# Altium schematic sheet CAN.SchDoc
size A4
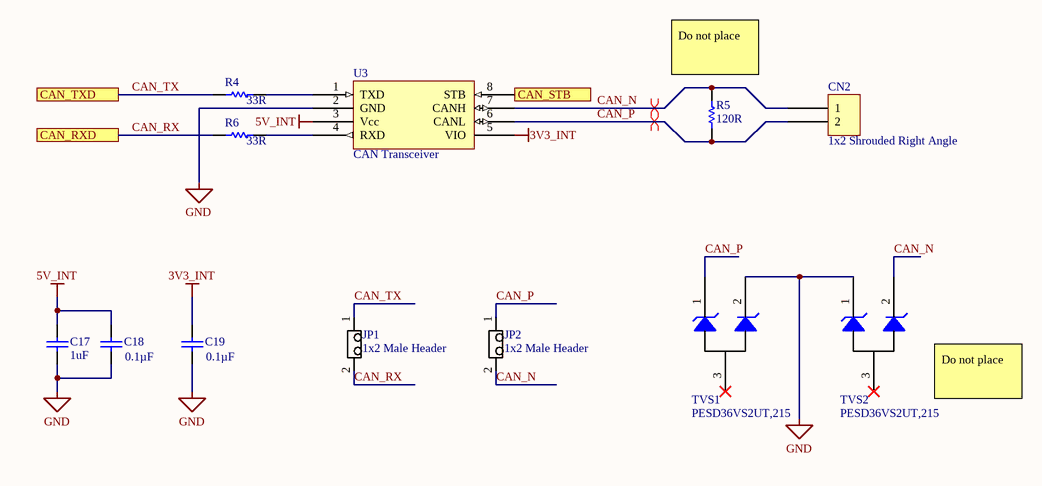
[diagram p0: CAN.SchDoc]

## Parts
C17  Capacitance: 1uF  [0803 CAP]  (hidden comment: CL21B105KBFNNNG)
C18  value 0.1µF  [CAPC2012N(0805")]  (hidden comment: 0.1uF 50V 0805 SMD, Ceramic)
C19  value 0.1µF  [CAPC2012N(0805")]  (hidden comment: 0.1uF 50V 0805 SMD, Ceramic)
CN2  1x2 Shrouded Right Angle  [2X1 Female Header]
JP1  1x2 Male Header  [2X1 Males Header]
JP2  1x2 Male Header  [2X1 Males Header]
R4  33R  [RESC1608X55X25LL10T15]
R5  120R  [RESC1608X55X25LL10T15]
R6  33R  [RESC1608X55X25LL10T15]
TVS1  PESD36VS2UT,215  [SOT95P245X110-3N]
TVS2  PESD36VS2UT,215  [SOT95P245X110-3N]
U3  CAN Transceiver  [8-SOIC]

## Ports
CAN_RXD, CAN_STB, CAN_TXD

## Nets
3V3_INT: C19.2(Cathode) U3.5(VIO)
5V_INT: C17.2 C18.2(Cathode) U3.3(Vcc)
GND: C17.1 C18.1(Anode) C19.1(Anode) TVS1.2(Cathode_2) TVS2.1(Cathode_1) U3.2(GND)
CAN_N: CN2.1 JP2.2 R5.2 TVS2.2(Cathode_2) U3.7(CANH)
CAN_P: CN2.2 JP2.1 R5.1 TVS1.1(Cathode_1) U3.6(CANL)
CAN_RX: JP1.2 R6.1 ; port CAN_RXD
CAN_STB: U3.8(STB) ; port CAN_STB
CAN_TX: JP1.1 R4.1 ; port CAN_TXD
NetR4_2: R4.2 U3.1(TXD)
NetR6_2: R6.2 U3.4(RXD)

Not connected (* = marked no-connect by the designer): TVS1 3(Common_Anode); TVS2 3(Common_Anode)

## Layout directives
differential pair; differential pair; differential pair; differential pair; differential pair: CAN_N
differential pair: CAN_P

## Notes on the sheet
- (near R5) Do not place
- (near TVS2) Do not place

## Library data of the parts
C17 = CMP-00005-3: SAMSUNG ELECTRO-MECHANICS - CL21B105KBFNNNG - MLCC CAPACITORS; Tolerance: 10%; Voltage Rating: 50V; Material: Ceramic; Dielectric: X7R; Case/Package: 0805; Contact Plating: Tin; Max Operating Temperature: 125°C; Termination: Wraparound; Package Quantity: 3000; Depth: 1.25mm; Mount: Surface Mount; Min Operating Temperature: -55°C; Thickness: 0.053inch; Packaging: Tape and Reel; Voltage: 50V; Case Code (Metric): 2012; Length: 2mm; Case Code (Imperial): 0805; Width: 0.049inch
C18 C19 = CMP-006-0006-1: Capacitor, Ceramic, 50V, +/-5%, 0805 SMD, X7R; Source: AUVic_Schematic_Library_Capacitors.SchLib; Component Type: Standard; PackageDescription: Chip Capacitor; Publisher: AUVic; Pin Count: 2; Published: 2016-03-16; Design Item ID: 0.1uF 50V 0805 SMD, Ceramic
CN2 = CMP-00010-3: 02 MTE HDR SRRA LATCH; Connector Type: Plug,Header,Pin; Backwall/Post Interruptions: No (Without); Pitch: 2.54mm; Approvals: CSA; Gender: Male; Contact Resistance: 15mR; PCB Thickness: 0.062inch; Contact Current Rating: 3A; Contact Retention: Yes (With); Number of Contacts: 2; PCB Mount Retention: Without; Insulation Resistance: 5GR; Row Spacing: 0.1inch; Tail Length: 3.3mm; Contact Plating: Gold,Tin,Matte; ELV: Compliant; Height: 13.59mm; Package Quantity: 68; Current Rating: 3A; Mount: Through Hole; Number of Rows: 1; Contact Material: Brass; Max Operating Temperature: 105°C; Lead Free: Lead Free; Mating Alignment: Yes (With); Min Operating Temperature: -65°C; Flammability Rating: UL94 V-0; Mating Retention: Yes (With); Color: Black; Number of Positions: 2; REACH SVHC: Unknown; Contact Mating Length: 0.23inch; Orientation: Right Angle; Packaging: Rail/Tube; Termination: Crimp; PCB Mount Alignment: No (Without); Contact Shape: Square; PCB Mounting Orientation: Right Angle; Housing Color: Black; Depth: 13.59mm; Length: 7.62mm; Contact Gender: Male; Strain Relief: No (Without); Housing Material: Thermoplastic
JP1 JP2 = CMP-004-0001-1: Made By: Andy Bates; Source: AUVic_Schematic_Library_Connectors.SchLib; Pin Count: 2; Design Item ID: 1x2 Male Header; Component Type: Standard
R4 R6 = CMP-00060-1: Res Thick Film 0603 33 Ohm 1% 1/10W +/-100ppm/ßC Molded SMD Paper T/R; Max Power Dissipation: 100mW; Voltage Rating: 75V; Voltage Rating (DC): 50V; Temperature Coefficient: 100ppm/°C; Depth: 0.8mm; Military Standard: Not; Min Operating Temperature: -55°C; Termination: SMD/SMT; Weight: 7.1E-05oz; Number of Terminations: 2; Height: 0.45mm; Power Rating: 100mW; Composition: Thick Film; Length: 1.6mm; Packaging: Tape and Reel; Resistance: 33R; Lead Pitch: 0.3mm; Lead Free: Lead Free; Max Operating Temperature: 155°C; REACH SVHC: No SVHC; Features: Moisture Resistant; Tolerance: 1%; Case/Package: 0603; Package Quantity: 1; Width: 0.8mm; Case Code (Metric): 1608; Number of Pins: 2; Case Code (Imperial): 0603
R5 = CMP-00061-1: Res Thick Film 0603 120 Ohm 1% 0.1W(1/10W) ±100ppm/C Epoxy SMD T/R; Power Rating: 100mW; Voltage Rating (DC): 50V; Temperature Coefficient: 100ppm/°C; Depth: 0.8mm; Max Operating Temperature: 155°C; Case/Package: 0603; Lead Free: Lead Free; Height: 0.022inch; Length: 1.6mm; Case Code (Metric): 1608; Package Quantity: 1; Features: Moisture Resistant; Termination: SMD/SMT; Military Standard: Not; Number of Pins: 2; Width: 0.031inch; REACH SVHC: No SVHC; Max Power Dissipation: 100mW; Min Operating Temperature: -55°C; Resistance: 120R; Packaging: Tape and Reel; Composition: Thick Film; Tolerance: 1%; Voltage Rating: 50V; Number of Terminations: 2; Case Code (Imperial): 0603
TVS1 TVS2 = CMP-058-0000-2: TVS DIODE 36V 60V SOT23; Created By: Miguel Manguerra; Date Created: 2020-05-18; Design Item ID: PESD36VS2UT,215; Component Type: Standard; Pin Count: 3; Source: AUVic_Schematic_Library_Diodes.SchLib
U3 = CMP-032-0000-2: 1/1 Transceiver Half CANbus 8-SO; Data Rate: 1Mbps; Max Supply Voltage: 5.5V; Propagation Delay: 250ns; Number of Transceivers: 1; Nominal Supply Current: 70mA; Min Supply Voltage: 4.5V; Min Operating Temperature: -40°C; Radiation Hardening: No; Packaging: Tape and Reel; Turn-On Delay Time: 250ns; Case/Package: SO; Contact Plating: Gold; Package Quantity: 2500; Number of Pins: 8; Max Supply Current: 70mA; Max Operating Temperature: 150°C; Interface: CAN; Mount: Surface Mount; Lead Free: Lead Free